# EAGLE design 001 (EAGLE 9.6.2)
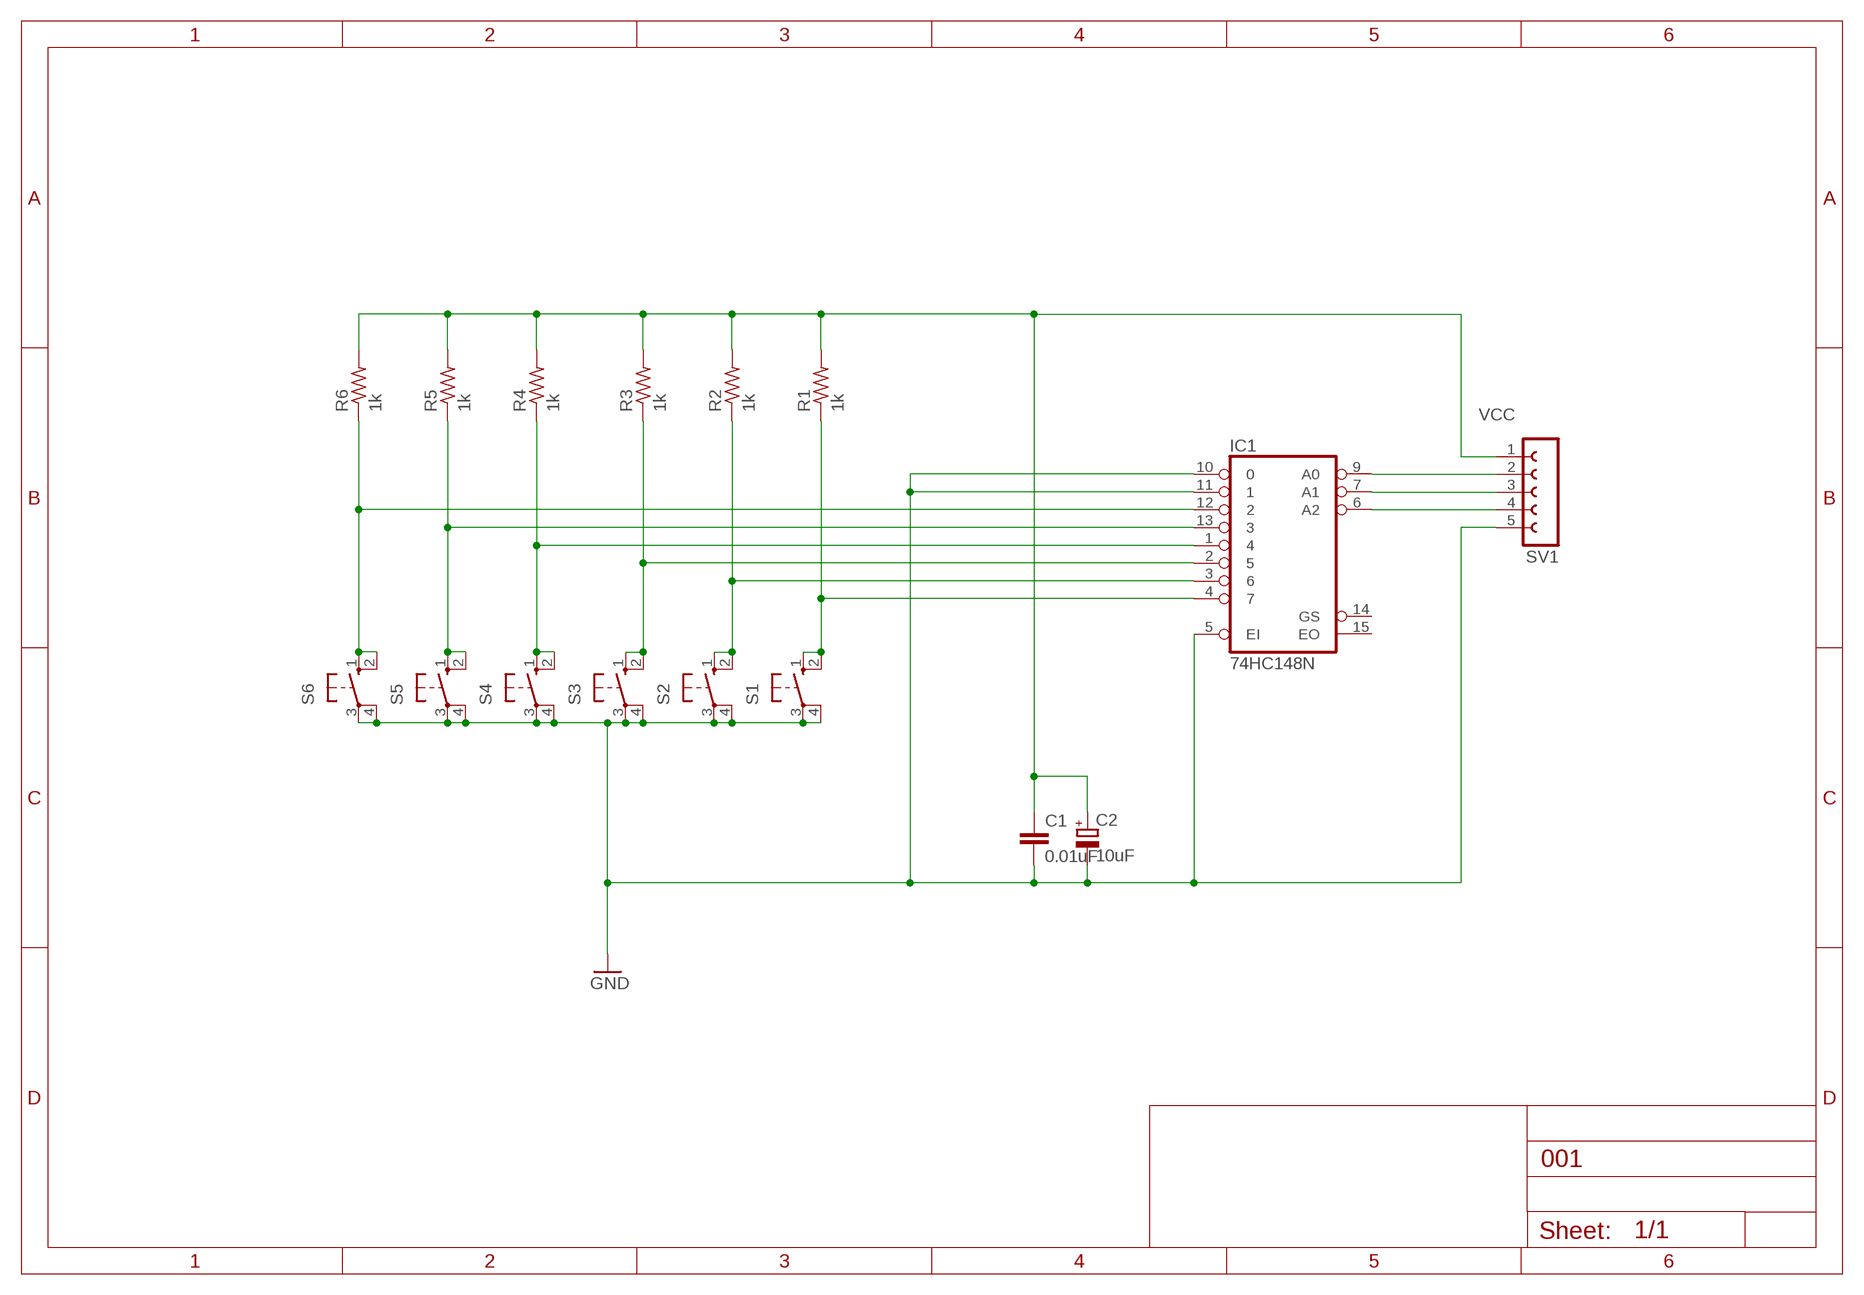
[diagram p0: schematic, sheet 1]

## Parts
C1  0.01uF  C-EU025-025X050  [C025-025X050]
C2  10uF  CPOL-EUE2,5-6E  [E2,5-6E]
IC1  74HC148N  [DIL16]
R1  1k  R-US_0207/7  [0207/7]
R2  1k  R-US_0207/7  [0207/7]
R3  1k  R-US_0207/7  [0207/7]
R4  1k  R-US_0207/7  [0207/7]
R5  1k  R-US_0207/7  [0207/7]
R6  1k  R-US_0207/7  [0207/7]
S1  10-XX  [B3F-10XX]
S2  10-XX  [B3F-10XX]
S3  10-XX  [B3F-10XX]
S4  10-XX  [B3F-10XX]
S5  10-XX  [B3F-10XX]
S6  10-XX  [B3F-10XX]
SV1  FE05-1  [FE05-1]

## Nets
GND: C1.2 C2.- IC1.5(EI) IC1.10 IC1.11 S1.3(P) S1.4(P1) S2.3(P) S2.4(P1) S3.3(P) S3.4(P1) S4.3(P) S4.4(P1) S5.3(P) S5.4(P1) S6.3(P) S6.4(P1) SV1.5
N$2: IC1.4 R1.1 S1.1(S) S1.2(S1)
N$3: IC1.3 R2.1 S2.1(S) S2.2(S1)
N$4: IC1.2 R3.1 S3.1(S) S3.2(S1)
N$5: IC1.1 R4.1 S4.1(S) S4.2(S1)
N$6: IC1.13 R5.1 S5.1(S) S5.2(S1)
N$7: IC1.12 R6.1 S6.1(S) S6.2(S1)
N$8: IC1.9(A0) SV1.2
N$9: IC1.7(A1) SV1.3
N$10: IC1.6(A2) SV1.4
VCC: C1.1 C2.+ R1.2 R2.2 R3.2 R4.2 R5.2 R6.2 SV1.1
Unconnected: IC1.14(GS) IC1.15(EO)

## Power pins joined to a net without a drawn wire
GND: IC1.8(GND)
VCC: IC1.16(VCC)

## Library data of the parts
C1 = rcl:C-EU: CAPACITOR, European symbol; SPICEPREFIX: C
C2 = rcl:CPOL-EU: POLARIZED CAPACITOR, European symbol; SPICEPREFIX: C
IC1 = 74xx-eu:74*148: 10-line to 4-line and 8-line to 3-line PRIORITY ENCODER
R1-R6 = rcl:R-US_: RESISTOR, American symbol; SPICEPREFIX: R
S1-S6 = switch-omron:10-XX: OMRON SWITCH
SV1 = con-lsta:FE05-1: FEMALE HEADER; OC_FARNELL: unknown; OC_NEWARK: unknown

## Board
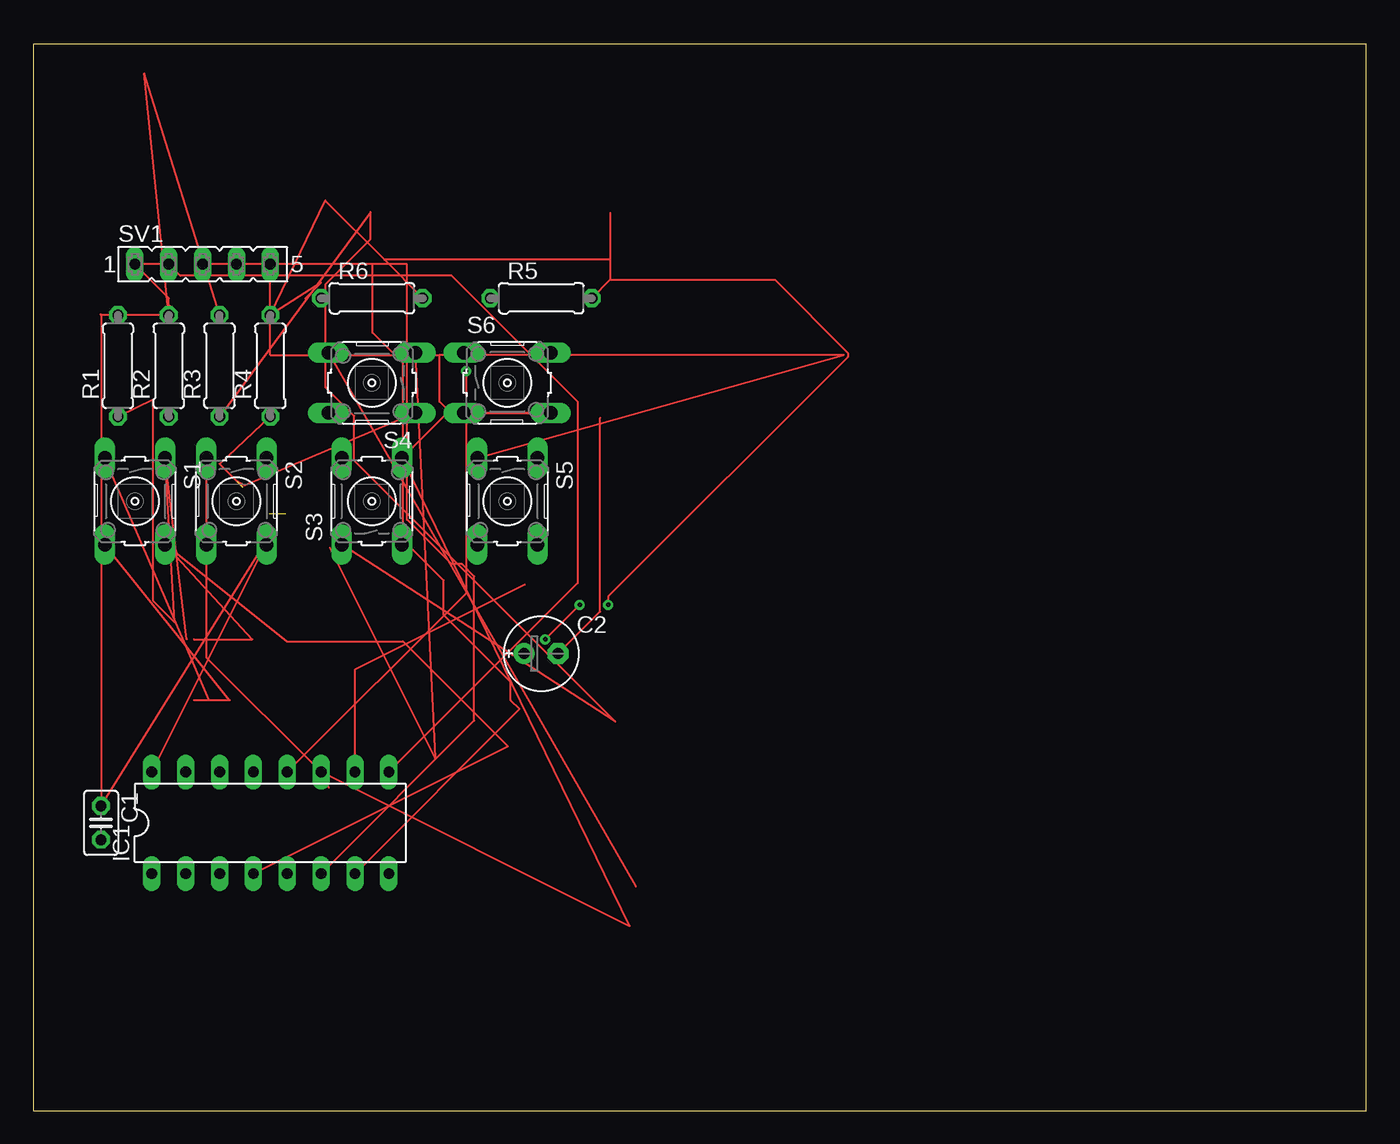
[diagram p1: board, top side]
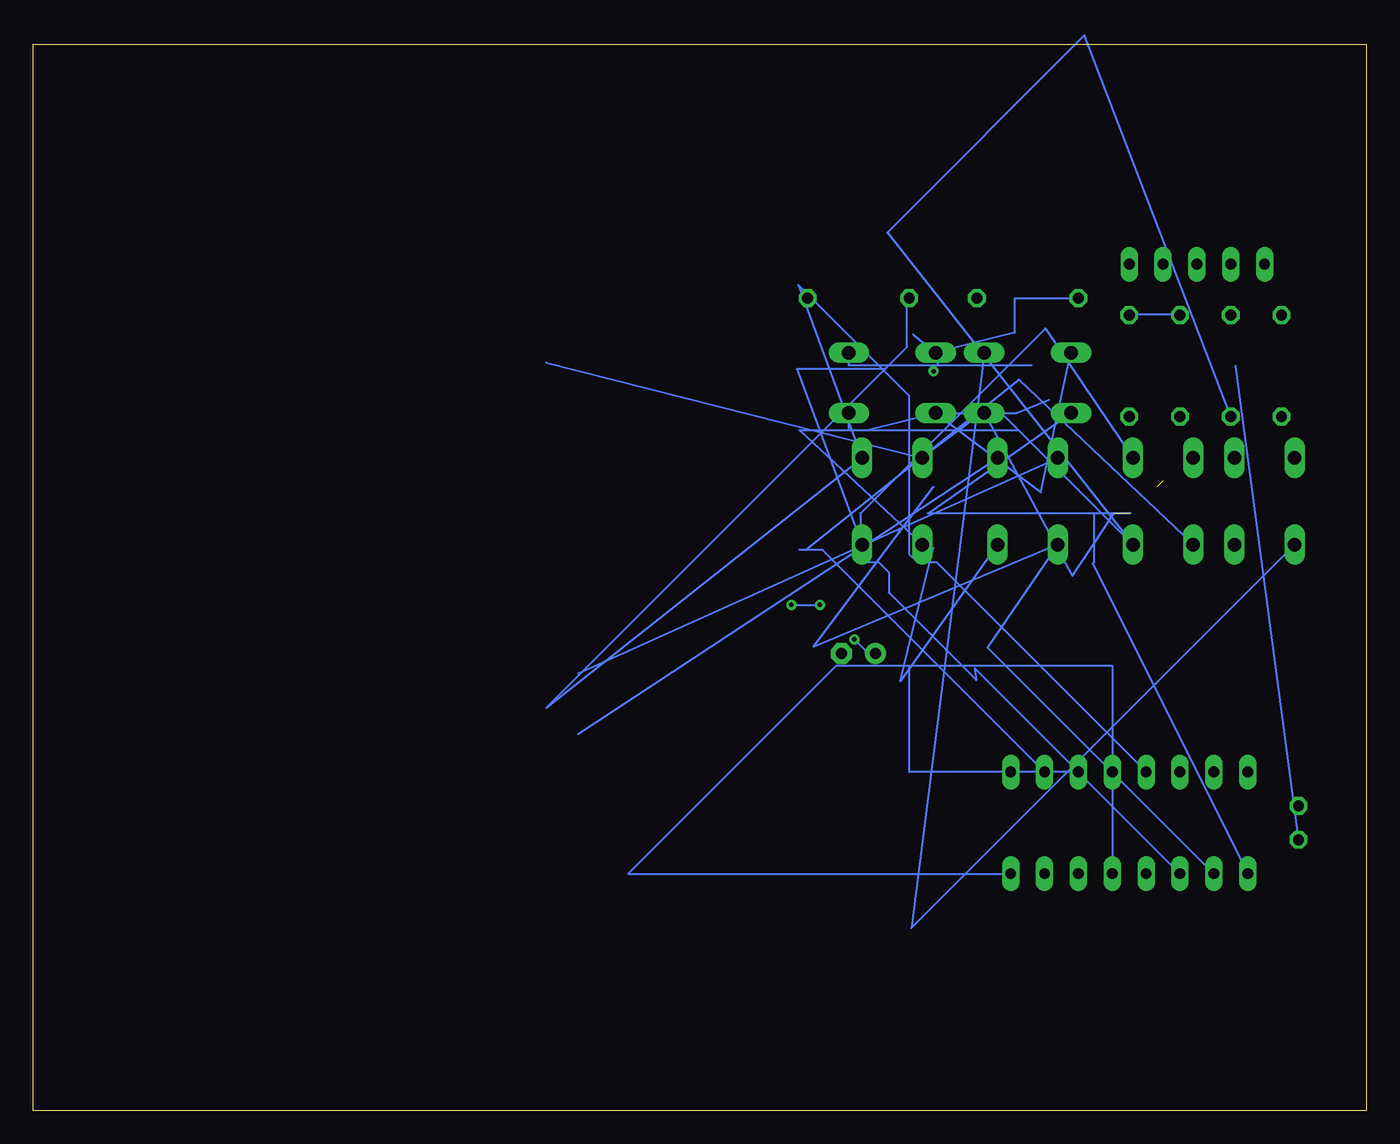
[diagram p2: board, bottom side, seen from below]

Size 100 x 80 mm. Coordinates in mm from the lower left corner, seen from the top.
Outline: 0,0 100,0 100,80 0,80 0,0
Copper layers (1*16): Top 0.035mm / dielectric 1.5mm / Bottom 0.035mm
Design rules "default": minimum track width 6mil, minimum drill 0.35mm, track to track 6mil, track to pad 6mil, pad to pad 6mil, via to via 6mil, smd to smd 6mil, copper to edge 40mil, drill to drill 6mil, minimum pad ring 10mil, minimum via ring 8mil, stop-mask expansion 4mil, vias tented up to drill 0mil, thermal gap 10mil

### Footprints (pad centres in the part's own frame; a part is rotated, then mirrored left to right if it is on the bottom)
C025-025X050 = drill 0.813 octagon: 1 -1.27,0; 2 1.27,0
E2,5-6E = drill 0.813 pad 1.575: + -1.27,0 | drill 0.813 pad 1.575 octagon: - 1.27,0
DIL16 = drill 0.813 long: 1 -8.89,-3.81; 2 -6.35,-3.81; 3 -3.81,-3.81; 4 -1.27,-3.81; 5 1.27,-3.81; 6 3.81,-3.81; 7 6.35,-3.81; 8 8.89,-3.81; 9 8.89,3.81; 10 6.35,3.81; 11 3.81,3.81; 12 1.27,3.81; 13 -1.27,3.81; 14 -3.81,3.81; 15 -6.35,3.81; 16 -8.89,3.81
0207/7 = drill 0.813 octagon: 1 -3.81,0; 2 3.81,0
B3F-10XX = drill 1.016 long: 1 -3.251,2.261; 2 3.251,2.261; 3 -3.251,-2.261; 4 3.251,-2.261
FE05-1 = drill 0.813 long: 1 -5.08,0; 2 -2.54,0; 3 0,0; 4 2.54,0; 5 5.08,0

### Placement (x,y rotation side)
C1  5.08,21.59 270 top
C2  38.1,34.29 0 top
IC1  17.78,21.59 0 top
R1  6.35,55.88 90 top
R2  10.16,55.88 90 top
R3  13.97,55.88 90 top
R4  17.78,55.88 90 top
R5  38.1,60.96 0 top
R6  25.4,60.96 0 top
S1  7.62,45.72 270 top
S2  15.24,45.72 270 top
S3  25.4,45.72 90 top
S4  25.4,54.61 180 top
S5  35.56,45.72 270 top
S6  35.56,54.61 0 top
SV1  12.7,63.5 0 top

### Tracks (layer width: path | path; a pad name or v marks a point on that pad's centre or on a via)
GND
  Top 0.152: IC1.10 24.13,33.1 36.88,39.47 | 22.17,24.23 IC1.11 | S2.3 12.98,42.52 | 12.98,42.52 S2.4 | S2.4 12.98,34.01 IC1.11 | IC1.11 44.72,13.83 S3.4 31.04,52.35 S6.4 31.32,52.35 30.48,53.19 30.48,56.69 | 12.04,30.79 14.73,30.79 11.43,34.9 | 13.21,30.79 11.43,34.9 | 11.43,34.9 S1.3 | 11.43,34.9 S1.4 | S4.3 30.14,26.45 22.25,42.22 | 45.21,16.82 S4.4 | C2.- 42.52,37.44 42.52,51.51 | SV1.5 17.78,56.69 30.48,56.69 | S5.3 42.51,51.56 | 42.51,51.56 60.78,56.69 30.48,56.69 | 11.43,34.9 | S2.4 12.95,42.52 12.98,42.52 | 42.52,51.51 42.52,51.97 | 42.52,51.51 42.51,51.56
  Bottom 0.152: S3.3 34.96,32.23 34.14,35.51 | 34.14,35.51 32.46,42.22 | 59.13,28.25 S3.4 27.74,48.92 | 19.05,28.8 19.05,33.38 34.29,33.38 | 19.05,28.8 IC1.5 | 34.29,33.38 34.29,25.4 24.23,25.4 | IC1.11 IC1.10 | IC1.10 24.23,25.4 | 34.29,33.38 39.78,33.38 55.37,17.78 IC1.8 | 42.52,42.06 40.79,42.06 34.19,35.46 | IC1.10 34.19,35.46 | 42.06,42.06 37.16,45.99 | 37.16,45.99 26.07,54.85 S2.4 | S1.4 7.76,40.07 | 7.76,40.07 19.04,28.79 | 19.04,28.79 34.13,13.7 S4.3 | 36.12,51.05 42.52,51.05 37.15,46.06 | 61.52,56.13 S5.3 | 37.15,46.06 S5.4 | 9.8,55.88 7.71,40.09 | 7.71,40.09 C1.2 | S6.3 26.25,52.35 23.77,53.34 | 26.06,51.05 38.81,51.05 S6.4 | 37.49,51.05 S6.3 | S4.4 24.39,46.41 27.74,48.92 | S6.3 27.74,48.92 | 37.15,46.06 37.19,46.02 37.16,45.99 | 34.14,35.51 | 34.14,35.51 34.19,35.46 | IC1.10 24.23,25.45 24.23,25.4 | 19.05,28.8 19.04,28.79 | 7.71,40.09 7.77,40.08 7.76,40.07
N$2
  Top 0.152: IC1.4 35.61,27.33 27.74,35.2 19.02,35.2 10.63,41.87 | 10.63,41.87 S1.2 16.43,35.36 12.04,35.36 | R1.1 8.99,53.34 8.99,38.25 10.62,36.63 S1.1 10.73,41.92 | 11.52,35.36 10.73,41.92 | 10.73,41.92 10.67,41.91 10.63,41.87
N$3
  Bottom 0.152: 34.85,47.9 24.08,58.68 S2.1 | 34.85,47.9 37.95,44.81 37.95,41.76 37.34,41.15 36.58,41.15 35.81,40.39 35.81,38.86 29.26,32.31 29.39,33.2 IC1.3 | R2.1 21.12,80.68 35.93,65.87 S2.2 28,52.97 34.85,47.9
N$4
  Top 0.152: R3.1 25.3,67.41 25.3,65.38 21.95,62.03 21.95,54.25 24.08,52.12 24.08,48.77 43.66,29.18 S3.1
  Bottom 0.152: IC1.2 28.41,34.76 S3.1 41.46,34.79 35,43.4 | 59.13,32.82 35.07,43.62 | 35.07,43.62 S3.2 | 35,43.4 32.46,46.79 | 35.07,43.62 35.05,43.59 35.05,43.43 35,43.4
N$5  (2 unrouted)
  Top 0.152: R4.1 13.97,48.51 15.7,46.79 | S4.1 15.85,46.91 15.24,47.24
  Bottom 0.152: 20.42,44.81 20.42,42.52 | 20.42,42.52 20.42,41.15 20.52,41.05 IC1.1 | S4.2 32.88,44.81 17.68,44.81 | S4.1 22.04,40.12 20.43,42.53 | 20.43,42.53 18.91,44.81 | 20.42,42.52 20.43,42.53
N$6
  Bottom 0.152: IC1.13 32.26,41.15 33.68,41.15 34.29,41.76 34.29,53.65 42.6,61.95 S5.1 61.52,30.23 36.12,55.63 | 36.12,55.63 34.44,57.3 34.44,60.96 R5.1 | 36.12,55.63 42.72,55.63 S5.2
N$7  (via drill 0.35)
  Top 0.152: IC1.12 32.46,38.81 v32.46,55.47 | 38.81,56.74 S6.2
  Bottom 0.152: R6.1 26.36,60.96 26.36,58.36 S6.1 | 32.46,55.93 38.81,55.93 S6.2 | 32.46,55.93 32.16,55.93 | 32.16,55.93 25.09,55.93 | 33.98,58.23 S6.1 | 32.16,55.93 32.16,56.84 S6.1 | v32.46,55.47 32.46,55.93
N$8
  Top 0.152: SV1.2 11.02,62.64 31.39,62.64 40.84,53.19 40.84,39.57 IC1.9
N$9
  Top 0.152: IC1.7 36.47,30.12 35.81,30.79 35.81,32.16 30.79,37.19 30.79,39.78 27.74,42.82 27.74,56.08 25.45,58.37 25.45,63.5 SV1.3
N$10
  Top 0.152: IC1.6 33.07,29.26 33.07,40.08 32.16,41 31.39,41 28.04,44.35 28.04,63.5 SV1.4
VCC  (via drill 0.35)
  Top 0.152: 10.26,60.38 R2.2 | R5.2 43.28,62.33 | 43.28,67.36 43.28,63.86 | 43.28,63.86 43.28,62.33 | R6.2 26.34,63.83 | 26.34,63.83 21.89,68.28 R4.2 21.59,62.13 20.42,60.96 | R3.2 8.32,77.82 R2.2 | 5.08,59.74 C1.1 17.78,43.18 IC1.16 | R2.2 10.16,60.96 SV1.1 10.26,63.5 | R2.2 R1.2 6.25,59.74 5.08,59.74 | 5.03,59.74 5.08,59.74 | v41,37.95 v38.41,35.36 | v43.13,37.95 43.13,38.56 61.11,56.54 61.11,56.84 55.63,62.33 43.28,62.33 | 43.28,63.86 26.36,63.86 26.34,63.83
  Bottom 0.152: R4.2 17.68,59.74 14.02,59.74 R3.2 | C2.+ 37.34,34.29 v38.41,35.36 | v43.13,37.95 v41,37.95